# Altium schematic sheet OpenRing_Debug_Main.SchDoc
size A4; SheetNumber: 1; SheetTotal: 4; Size: A4
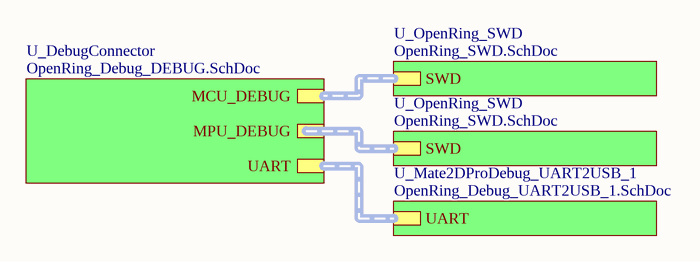
[diagram p0: OpenRing_Debug_Main.SchDoc]

## Sub-sheets
U_DebugConnector = OpenRing_Debug_DEBUG.SchDoc: MCU_DEBUG (harness MCU_DEBUG), MPU_DEBUG (harness MPU_DEBUG), UART (harness UART)
U_Mate2DProDebug_UART2USB_1 = OpenRing_Debug_UART2USB_1.SchDoc: UART (harness UART)
U_OpenRing_SWD = OpenRing_SWD.SchDoc: SWD (harness SWD)
U_OpenRing_SWD = OpenRing_SWD.SchDoc: SWD (harness SWD)

## Buses and harness runs
harness sheet U_DebugConnector/MCU_DEBUG = sheet U_OpenRing_SWD/SWD
harness sheet U_DebugConnector/MPU_DEBUG = sheet U_OpenRing_SWD/SWD
harness sheet U_DebugConnector/UART = sheet U_Mate2DProDebug_UART2USB_1/UART

## Notes on the sheet
- Designer/Engineer
- Drawn By
- Document Name
- Board Title
- Sheet
- of
- Size
- Approved By
- Rev.
- Date